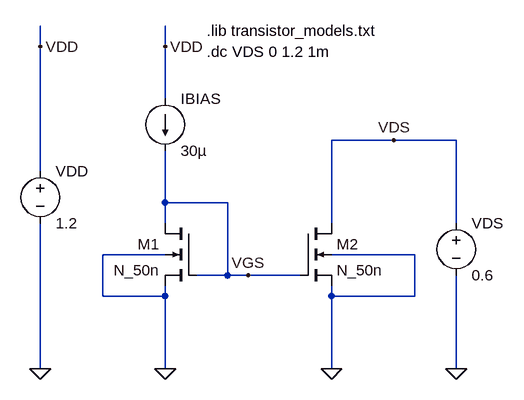
[diagram p0: schematic lab08_nmos_current_mirror.asc]
lab08_nmos_current_mirror.asc, the LTspice schematic file:
Version 4
SHEET 1 936 680
WIRE 16 -160 16 -192
WIRE 208 -160 208 -192
WIRE 208 -80 208 -160
WIRE 560 -16 464 -16
WIRE 656 -16 560 -16
WIRE 16 32 16 -160
WIRE 208 80 208 0
WIRE 304 80 208 80
WIRE 208 112 208 80
WIRE 464 112 464 -16
WIRE 656 112 656 -16
WIRE 208 160 112 160
WIRE 592 160 464 160
WIRE 304 192 304 80
WIRE 304 192 256 192
WIRE 336 192 304 192
WIRE 416 192 336 192
WIRE 112 224 112 160
WIRE 208 224 208 208
WIRE 208 224 112 224
WIRE 464 224 464 208
WIRE 592 224 592 160
WIRE 592 224 464 224
WIRE 16 336 16 112
WIRE 208 336 208 224
WIRE 464 336 464 224
WIRE 656 336 656 192
FLAG 208 336 0
FLAG 16 336 0
FLAG 16 -160 VDD
FLAG 208 -160 VDD
FLAG 464 336 0
FLAG 656 336 0
FLAG 560 -16 VDS
FLAG 336 192 VGS
SYMBOL nmos4 256 112 M0
SYMATTR InstName M1
SYMATTR Value2 l=1u w=10u
SYMATTR Value N_50n
SYMBOL current 208 -80 R0
WINDOW 123 0 0 Left 0
WINDOW 39 0 0 Left 0
SYMATTR InstName IBIAS
SYMATTR Value 30µ
SYMBOL voltage 16 16 R0
WINDOW 123 0 0 Left 0
WINDOW 39 0 0 Left 0
SYMATTR InstName VDD
SYMATTR Value 1.2
SYMBOL nmos4 416 112 R0
SYMATTR InstName M2
SYMATTR Value2 l=1u w=10u
SYMATTR Value N_50n
SYMBOL voltage 656 96 R0
WINDOW 123 0 0 Left 0
WINDOW 39 0 0 Left 0
SYMATTR InstName VDS
SYMATTR Value 0.6
TEXT 272 -184 Left 2 !.lib transistor_models.txt
TEXT 272 -152 Left 2 !.dc VDS 0 1.2 1m

The netlist it stands for:
* lab08_nmos_current_mirror.asc
M1 VGS VGS 0 0 N_50n l=1u w=10u
IBIAS VDD VGS 30µ
VDD VDD 0 1.2
M2 VDS VGS 0 0 N_50n l=1u w=10u
VDS VDS 0 0.6
.model NMOS NMOS
.model PMOS PMOS
.lib standard.mos
.lib transistor_models.txt
.dc VDS 0 1.2 1m
.backanno
.end

* Results of the author's LTspice run, read from the files saved beside the schematic
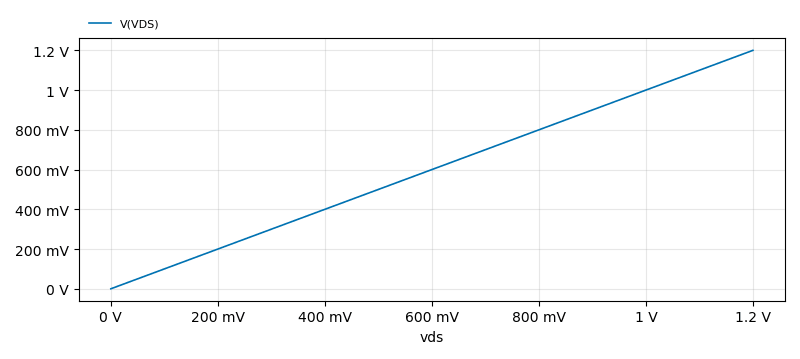
[diagram p1: DC transfer characteristic of lab08_nmos_current_mirror.asc, plotted from the saved traces]
* DC transfer characteristic, 1 run:
*   V(VDS): 0 V at vds=0 V, 1.2 V at vds=1.2 V, min 0 V, max 1.2 V